# EAGLE design top_prog (EAGLE 9.6.1)
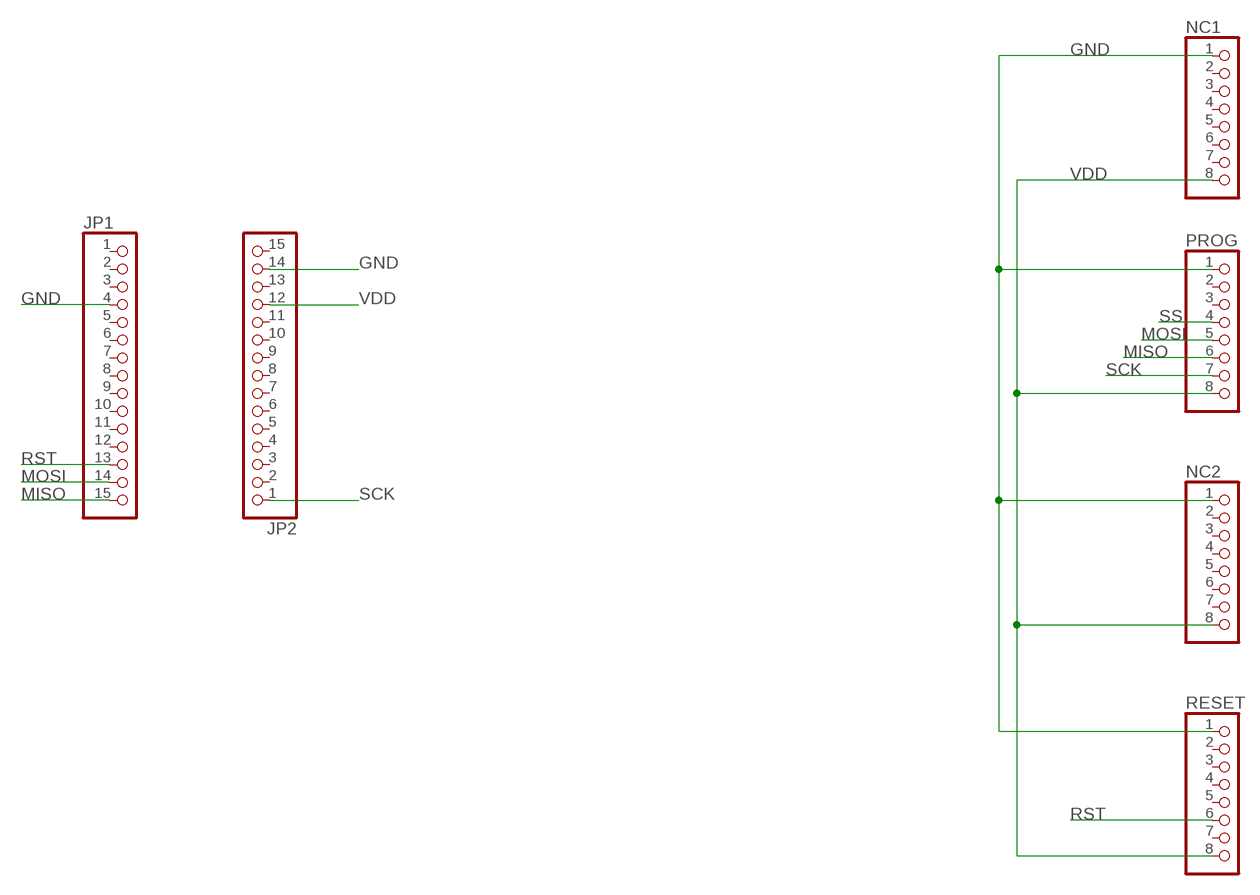
[diagram p0: schematic, sheet 1]

## Parts
JP1  PINHD-1X15  [1X15]
JP2  PINHD-1X15  [1X15]
NC1  PINHD-1X8  [1X08]
NC2  PINHD-1X8  [1X08]
PROG  PINHD-1X8  [1X08]
RESET  PINHD-1X8  [1X08]

## Nets
GND: JP1.4 JP2.14 NC1.1 NC2.1 PROG.1 RESET.1
MISO: JP1.15 PROG.6
MOSI: JP1.14 PROG.5
RST: JP1.13 RESET.6
SCK: JP2.1 PROG.7
SS: PROG.4
VDD [pow_width]: JP2.12 NC1.8 NC2.8 PROG.8 RESET.8
Unconnected: JP1.1 JP1.2 JP1.3 JP1.5 JP1.6 JP1.7 JP1.8 JP1.9 JP1.10 JP1.11 JP1.12 JP2.2 JP2.3 JP2.4 JP2.5 JP2.6 JP2.7 JP2.8 JP2.9 JP2.10 JP2.11 JP2.13 JP2.15 NC1.2 NC1.3 NC1.4 NC1.5 NC1.6 NC1.7 NC2.2 NC2.3 NC2.4 NC2.5 NC2.6 NC2.7 PROG.2 PROG.3 RESET.2 RESET.3 RESET.4 RESET.5 RESET.7

## Library data of the parts
JP1 JP2 = pinhead:PINHD-1X15: PIN HEADER
NC1 NC2 PROG RESET = pinhead:PINHD-1X8: PIN HEADER

## Net classes
1 pow_width: width 0.102 mm

## Board
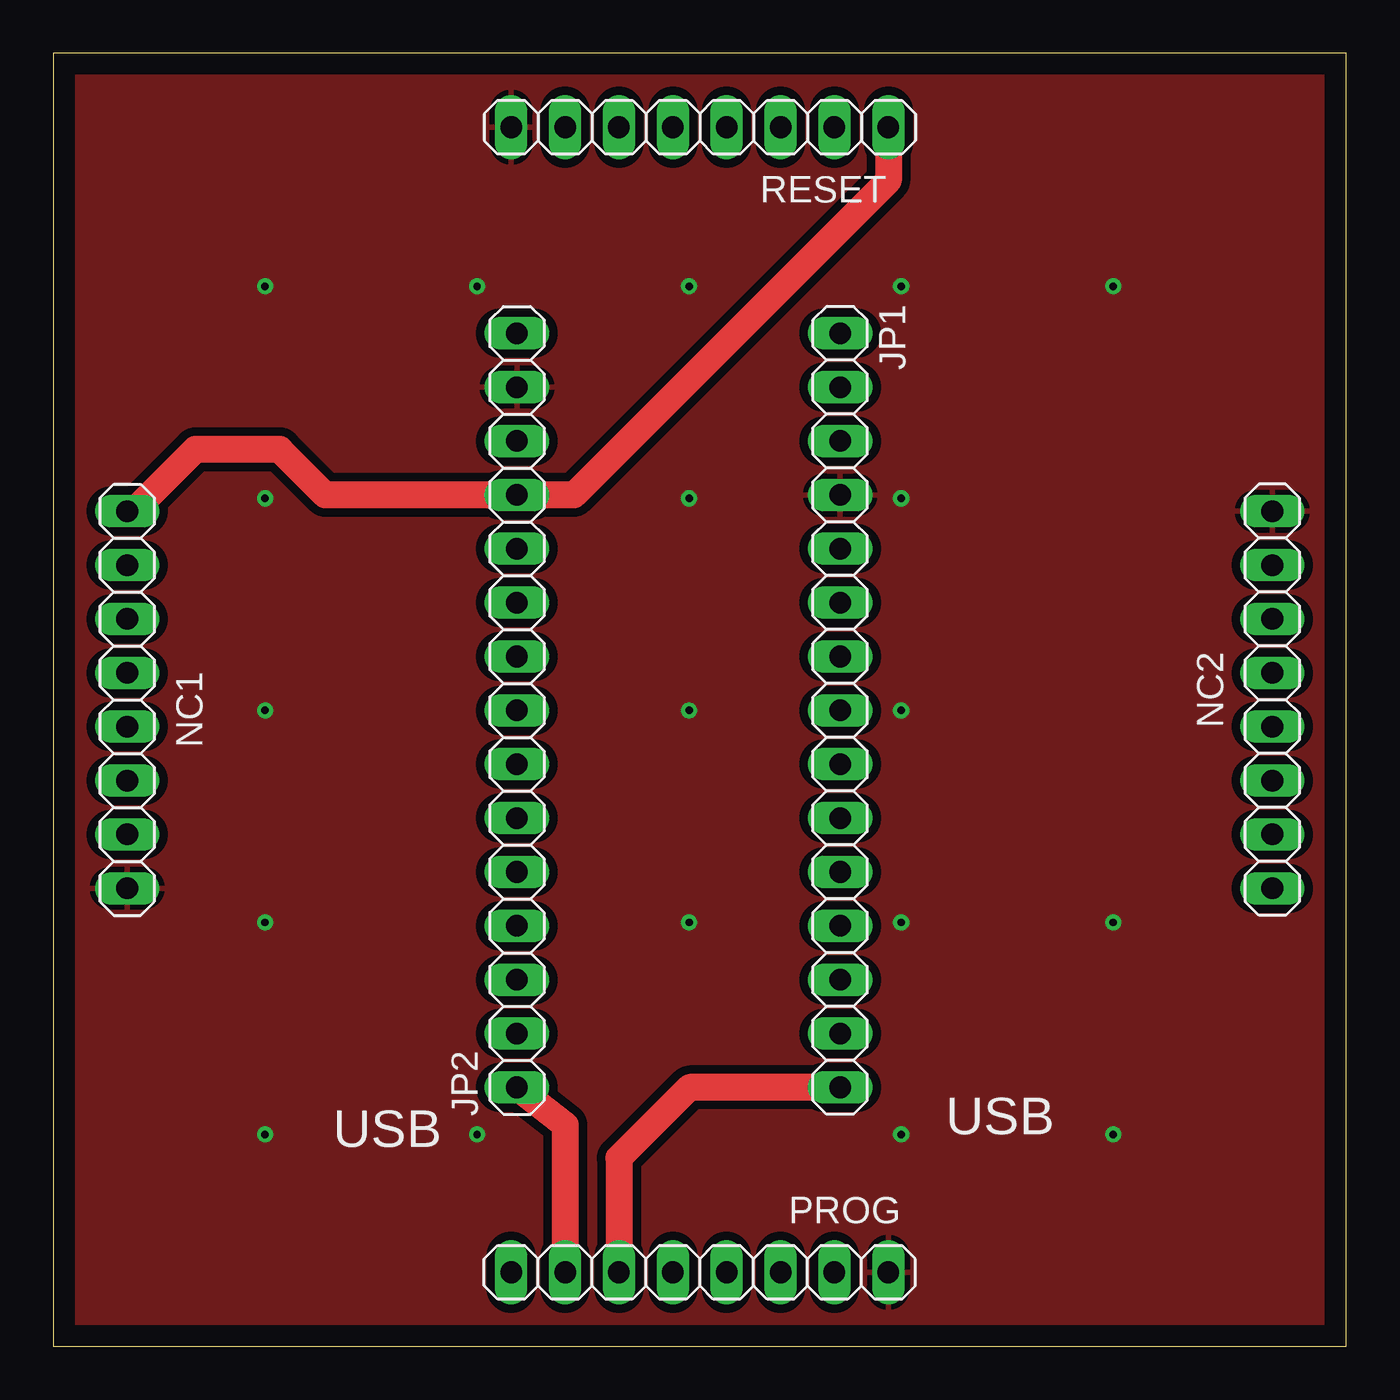
[diagram p1: board, top side]
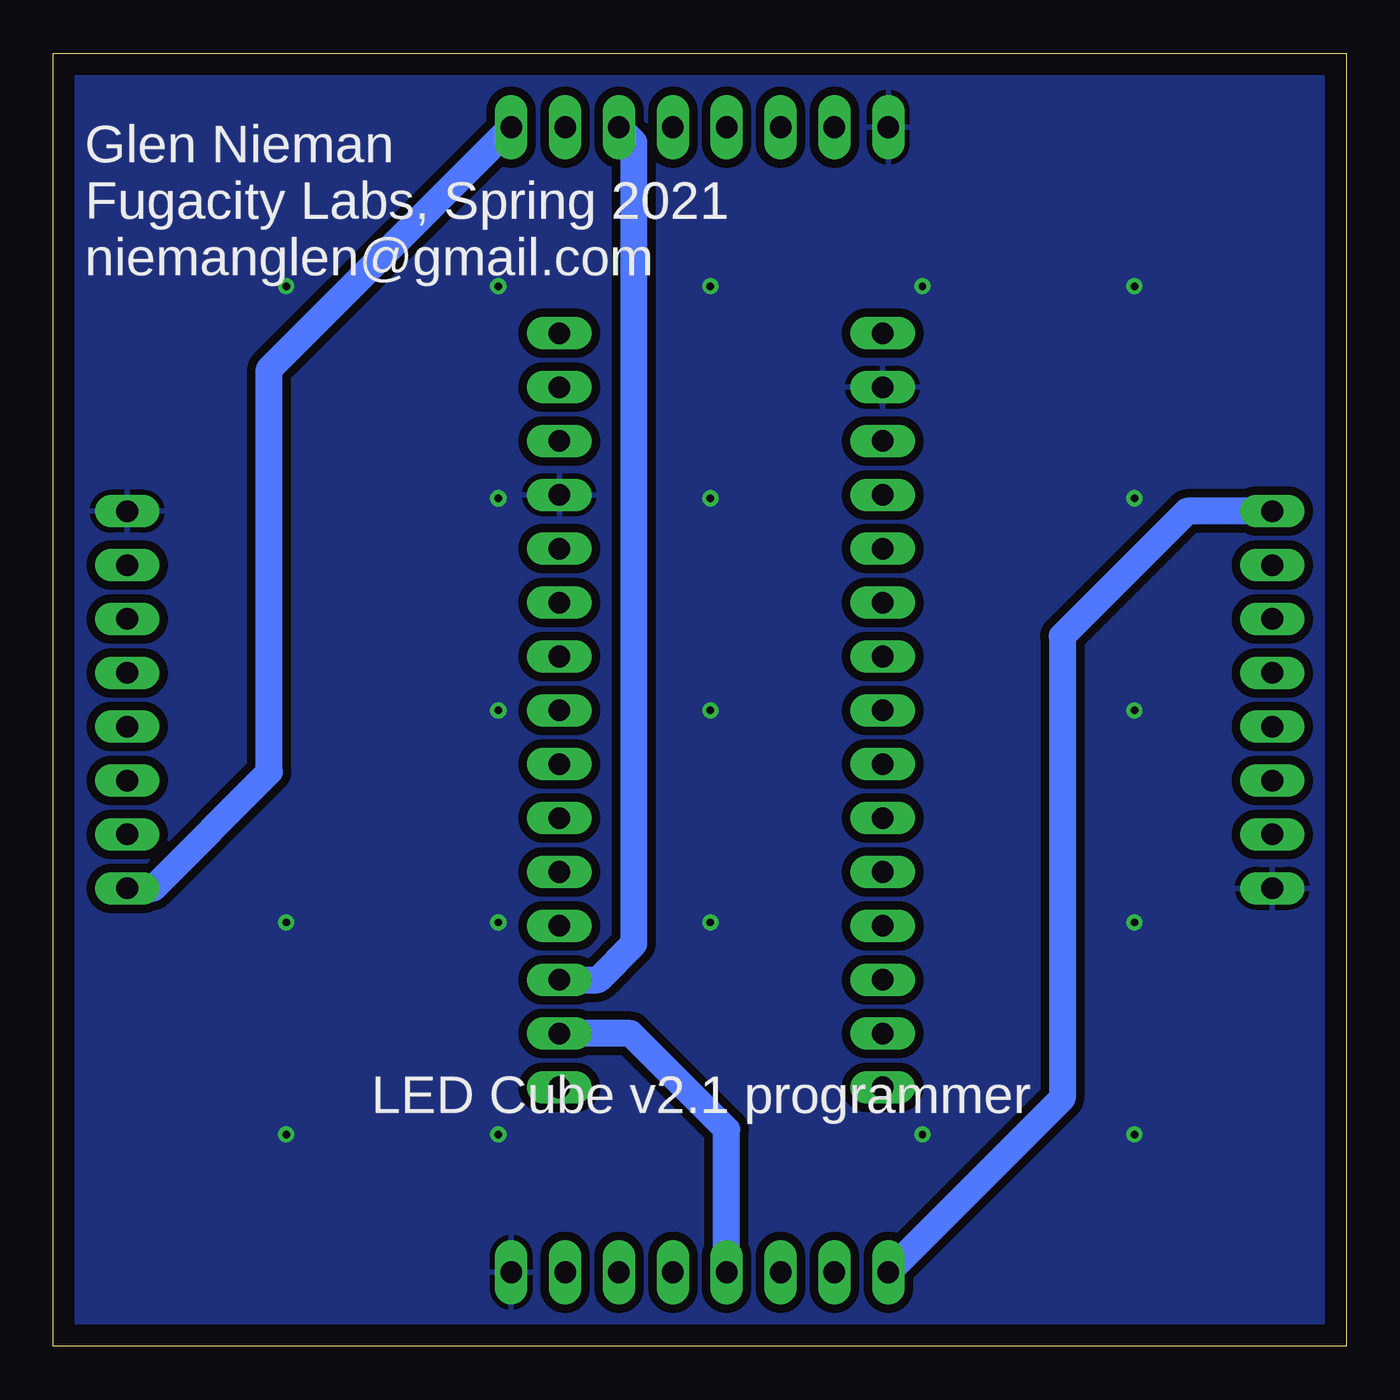
[diagram p2: board, bottom side, seen from below]

Size 61 x 61 mm. Coordinates in mm from the lower left corner, seen from the top.
Outline: 0,0 61,0 61,61 0,61 0,0
Copper layers (1*16): Top 0.035mm / dielectric 1.5mm / Bottom 0.035mm
Design rules "default *": minimum track width 6mil, minimum drill 0.35mm, track to track 6mil, track to pad 6mil, pad to pad 6mil, via to via 6mil, smd to smd 6mil, copper to edge 40mil, drill to drill 6mil, minimum pad ring 10mil, minimum via ring 8mil, stop-mask expansion 4mil, vias tented up to drill 100mil, thermal gap 10mil

### Footprints (pad centres in the part's own frame; a part is rotated, then mirrored left to right if it is on the bottom)
1X15 = drill 1.016 long: 1 -17.78,0; 2 -15.24,0; 3 -12.7,0; 4 -10.16,0; 5 -7.62,0; 6 -5.08,0; 7 -2.54,0; 8 0,0; 9 2.54,0; 10 5.08,0; 11 7.62,0; 12 10.16,0; 13 12.7,0; 14 15.24,0; 15 17.78,0
1X08 = drill 1.016 long: 1 -8.89,0; 2 -6.35,0; 3 -3.81,0; 4 -1.27,0; 5 1.27,0; 6 3.81,0; 7 6.35,0; 8 8.89,0

### Placement (x,y rotation side)
JP1  37.12,30 270 top
JP2  21.88,30 90 top
NC1  3.5,30.5 90 top
NC2  57.5,30.5 270 top
PROG  30.5,3.5 180 top
RESET  30.5,57.5 0 top

### Tracks (layer width: path | path; a pad name or v marks a point on that pad's centre or on a via)
GND  (via drill 0.35)
  other vias: 10,10 20,10 40,10 50,10 50,20 40,20 30,20 10,20 10,30 30,30 40,30 40,40 30,40 10,40 10,50 20,50 30,50 40,50 50,50
  pour Top (isolate 0.406): 0,0 0,61 61,61 61,0
  pour Bottom (isolate 0.406): 0,0 0,61 61,61 61,0
MISO
  Top 1.27: JP1.15 30.02,12.22 26.69,8.89 PROG.6
MOSI
  Bottom 1.27: PROG.5 29.23,10.23 33.76,14.76 JP1.14
RST
  Bottom 1.27: JP1.13 35.3,17.3 33.6,19 33.6,56.79 RESET.6
SCK
  Top 1.27: JP2.1 24.15,10.45 PROG.7
VDD
  Top 1.27: NC1.8 3.8,39.39 6.71,42.3 10.7,42.3 12.84,40.16 JP2.12 24.56,40.16 39.39,54.99 RESET.8
  Bottom 1.27: NC2.8 56.29,21.61 50.8,27.1 50.8,46.09 RESET.8 | NC1.8 7.51,39.39 13.4,33.5 13.4,11.71 PROG.8

### Text on the board
tPlace: USB | USB
bPlace: Glen Nieman / Fugacity Labs, Spring 2021 / niemanglen@gmail.com | LED Cube v2.1 programmer